# EAGLE design pic_circuit (EAGLE 9.6.2)
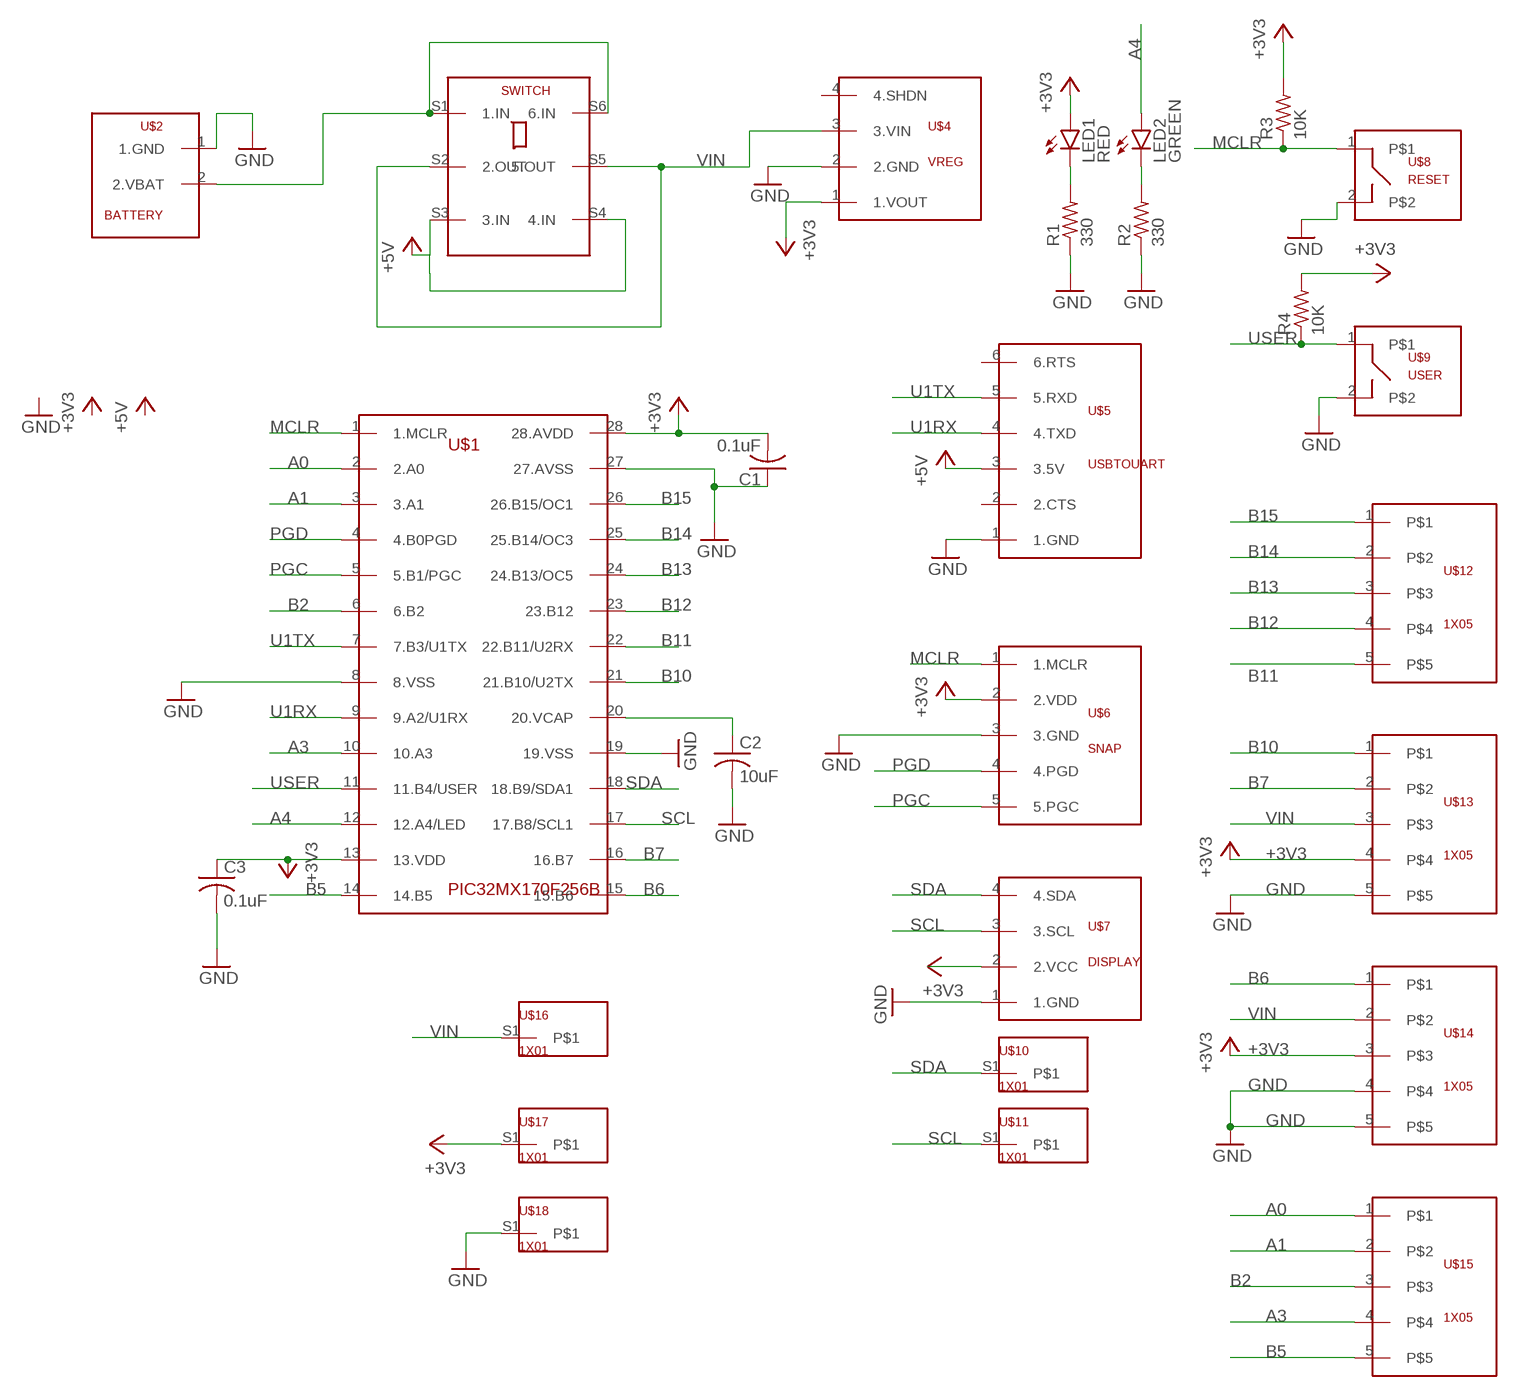
[diagram p0: schematic, sheet 1]

## Parts
C1  0.1uF  C-US025-024X044  [C025-024X044]
C2  10uF  C-US025-024X044  [C025-024X044]
C3  0.1uF  C-US025-024X044  [C025-024X044]
LED1  RED  LED3MM  [LED3MM]
LED2  GREEN  LED3MM  [LED3MM]
R1  330  R-US_0207/7  [0207/7]
R2  330  R-US_0207/7  [0207/7]
R3  10K  R-US_0207/7  [0207/7]
R4  10K  R-US_0207/7  [0207/7]
SWITCH  SLIDE  [SWITCH]
U$1  PIC32MX170F256B  [DIL28-3]
U$2  BATTERY  [BATTERY]
U$4  VREG  [VREG]
U$5  USBTOUART  [1X06]
U$6  SNAP  [SNAP]
U$7  DISPLAY  [DISPLAY]
U$8  RESET  BUTTON  [BUTTON]
U$9  USER  BUTTON  [BUTTON]
U$10  1X01  [1X01_EE]
U$11  1X01  [1X01_EE]
U$12  1X05  [1X05_EE]
U$13  1X05  [1X05_EE]
U$14  1X05  [1X05_EE]
U$15  1X05  [1X05_EE]
U$16  1X01  [1X01_EE]
U$17  1X01  [1X01_EE]
U$18  1X01  [1X01_EE]

## Nets
+3V3: C1.2 C3.1 LED1.A R3.2 R4.2 U$1.13(13.VDD) U$1.28(28.AVDD) U$4.1(1.VOUT) U$6.2(2.VDD) U$7.2(2.VCC) U$13.4 U$14.3 U$17.S1
+5V: SWITCH.S3(3.IN) SWITCH.S4(4.IN) U$5.3(3.5V)
A0: U$1.2(2.A0) U$15.1
A1: U$1.3(3.A1) U$15.2
A3: U$1.10(10.A3) U$15.4
A4: LED2.A U$1.12(12.A4/LED)
B2: U$1.6(6.B2) U$15.3
B5: U$1.14(14.B5) U$15.5
B6: U$1.15(15.B6) U$14.1
B7: U$1.16(16.B7) U$13.2
B10: U$1.21(21.B10/U2TX) U$13.1
B11: U$1.22(22.B11/U2RX) U$12.5
B12: U$1.23(23.B12) U$12.4
B13: U$1.24(24.B13/OC5) U$12.3
B14: U$1.25(25.B14/OC3) U$12.2
B15: U$1.26(26.B15/OC1) U$12.1
GND: C1.1 C2.2 C3.2 R1.1 R2.1 U$1.8(8.VSS) U$1.19(19.VSS) U$1.27(27.AVSS) U$2.1(1.GND) U$4.2(2.GND) U$5.1(1.GND) U$6.3(3.GND) U$7.1(1.GND) U$8.2 U$9.2 U$13.5 U$14.4 U$14.5 U$18.S1
MCLR: R3.1 U$1.1(1.MCLR) U$6.1(1.MCLR) U$8.1
N$1: LED1.K(C) R1.2
N$2: SWITCH.S1(1.IN) SWITCH.S6(6.IN) U$2.2(2.VBAT)
N$3: C2.1 U$1.20(20.VCAP)
N$5: LED2.K(C) R2.2
PGC: U$1.5(5.B1/PGC) U$6.5(5.PGC)
PGD: U$1.4(4.B0PGD) U$6.4(4.PGD)
SCL: U$1.17(17.B8/SCL1) U$7.3(3.SCL) U$11.S1
SDA: U$1.18(18.B9/SDA1) U$7.4(4.SDA) U$10.S1
U1RX: U$1.9(9.A2/U1RX) U$5.4(4.TXD)
U1TX: U$1.7(7.B3/U1TX) U$5.5(5.RXD)
USER: R4.1 U$1.11(11.B4/USER) U$9.1
VIN: SWITCH.S2(2.OUT) SWITCH.S5(5.OUT) U$4.3(3.VIN) U$13.3 U$14.2 U$16.S1
Unconnected: U$4.4(4.SHDN) U$5.2(2.CTS) U$5.6(6.RTS)

## Library data of the parts
C1-C3 = piccircuit:C-US: CAPACITOR, American symbol; SPICEPREFIX: C
LED1 LED2 = piccircuit:LED: LED OSRAM: - CHIPLED LG R971, LG N971, LY N971, LG Q971, LY Q971, LO R971, LY R971 LH N974, LH R974 LS Q976, LO Q976, LY Q976 LO Q996 - Hyper CHIPLED LW Q18S LB Q993, LB Q99A, LB R99A - SideLED LS A670, LO A670, LY A670, LG A670, LP A670 LB A673, LV A673, LT A673, LW A673 LH A674 LY A675 LS A676, LA A676, LO A676, LY A676, LW A676 LS A679, LY A679, LG A679 - Hyper Micro SIDELED® LS Y876, LA Y876, LO Y876, LY Y876 LT Y87S - SmartLED LW L88C, LW L88S LB L89C, LB L89S, LG L890 LS L89K, LO L89K, LY L89K LS L896, LA L896, LO L896, LY L896 - TOPLED LS T670, LO T670, LY T670, LG T670, LP T670 LSG T670, LSP T670, LSY T670, LOP T670, LYG T670 LG T671, LOG T671, LSG T671 LB T673, LV T673, LT T673, LW T673 LH T674 LS T676, LA T676, LO T676, LY T676, LB T676, LH T676, LSB T676, LW T676 LB T67C, LV T67C, LT T67C, LS T67K, LO T67K, LY T67K, LW E67C LS E67B, LA E67B, LO E67B, LY E67B, LB E67C, LV E67C, LT E67C LW T67C LS T679, LY T679, LG T679 LS T770, LO T770, LY T770, LG T770, LP T770 LB T773, LV T773, LT T773, LW T773 LH T774 LS E675, LA E675, LY E675, LS T675 LS T776, LA T776, LO T776, LY T776, LB T776 LHGB T686 LT T68C, LB T68C - Hyper Mini TOPLED® LB M676 - Mini TOPLED Santana® LG M470 LS M47K, LO M47K, LY M47K Source: http://www.osram.convergy.de LUXEON: - LUMILED® LXK2-PW12-R00, LXK2-PW12-S00, LXK2-PW14-U00, LXK2-PW14-V00 LXK2-PM12-R00, LXK2-PM12-S00, LXK2-PM14-U00 LXK2-PE12-Q00, LXK2-PE12-R00, LXK2-PE12-S00, LXK2-PE14-T00, LXK2-PE14-U00 LXK2-PB12-K00, LXK2-PB12-L00, LXK2-PB12-M00, LXK2-PB14-N00, LXK2-PB14-P00, LXK2-PB14-Q00 LXK2-PR12-L00, LXK2-PR12-M00, LXK2-PR14-Q00, LXK2-PR14-R00 LXK2-PD12-Q00, LXK2-PD12-R00, LXK2-PD12-S00 LXK2-PH12-R00, LXK2-PH12-S00 LXK2-PL12-P00, LXK2-PL12-Q00, LXK2-PL12-R00 Source: www.luxeon.com KINGBRIGHT: KA-3528ASYC Source: www.kingbright.com
R1-R4 = piccircuit:R-US_: RESISTOR, American symbol; SPICEPREFIX: R
SWITCH = piccircuit:SLIDE
U$1 = piccircuit:PIC32MX170F256B
U$2 = piccircuit:BATTERY
U$4 = piccircuit:VREG
U$5 = piccircuit:USBTOUART
U$6 = piccircuit:SNAP
U$7 = piccircuit:DISPLAY
U$8 U$9 = piccircuit:BUTTON
U$10 U$11 U$16-U$18 = piccircuit:1X01
U$12-U$15 = piccircuit:1X05

## Board
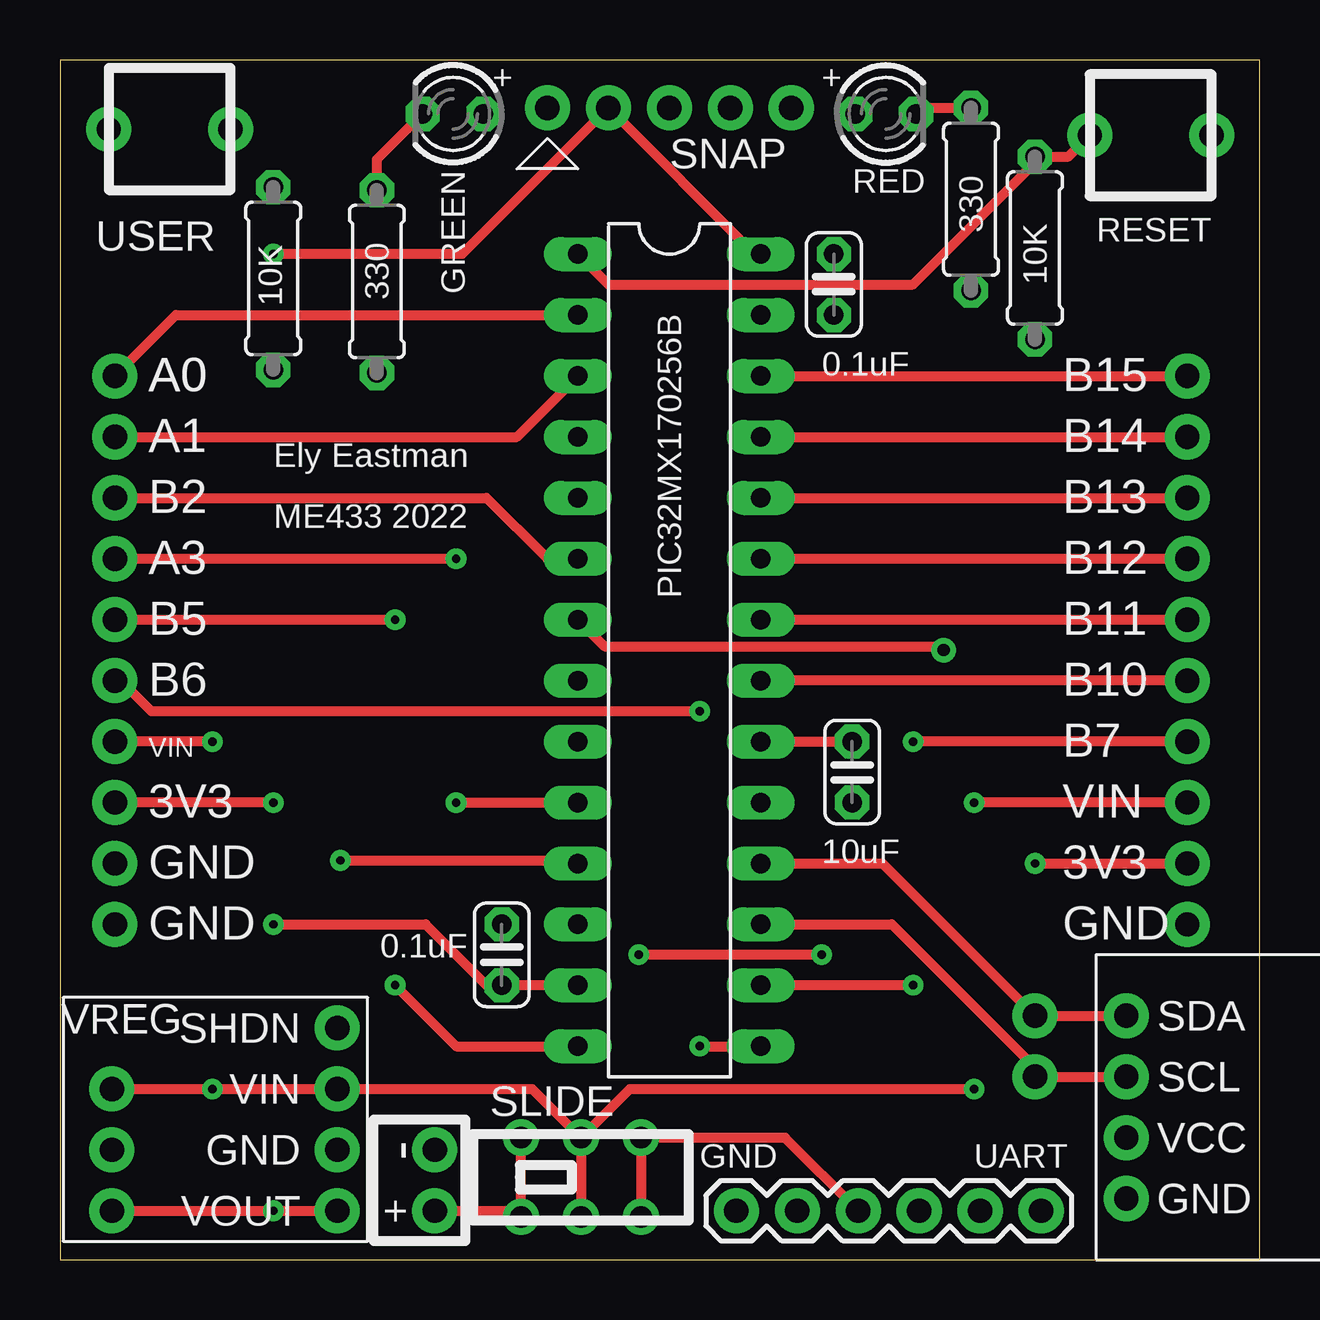
[diagram p1: board, top side]
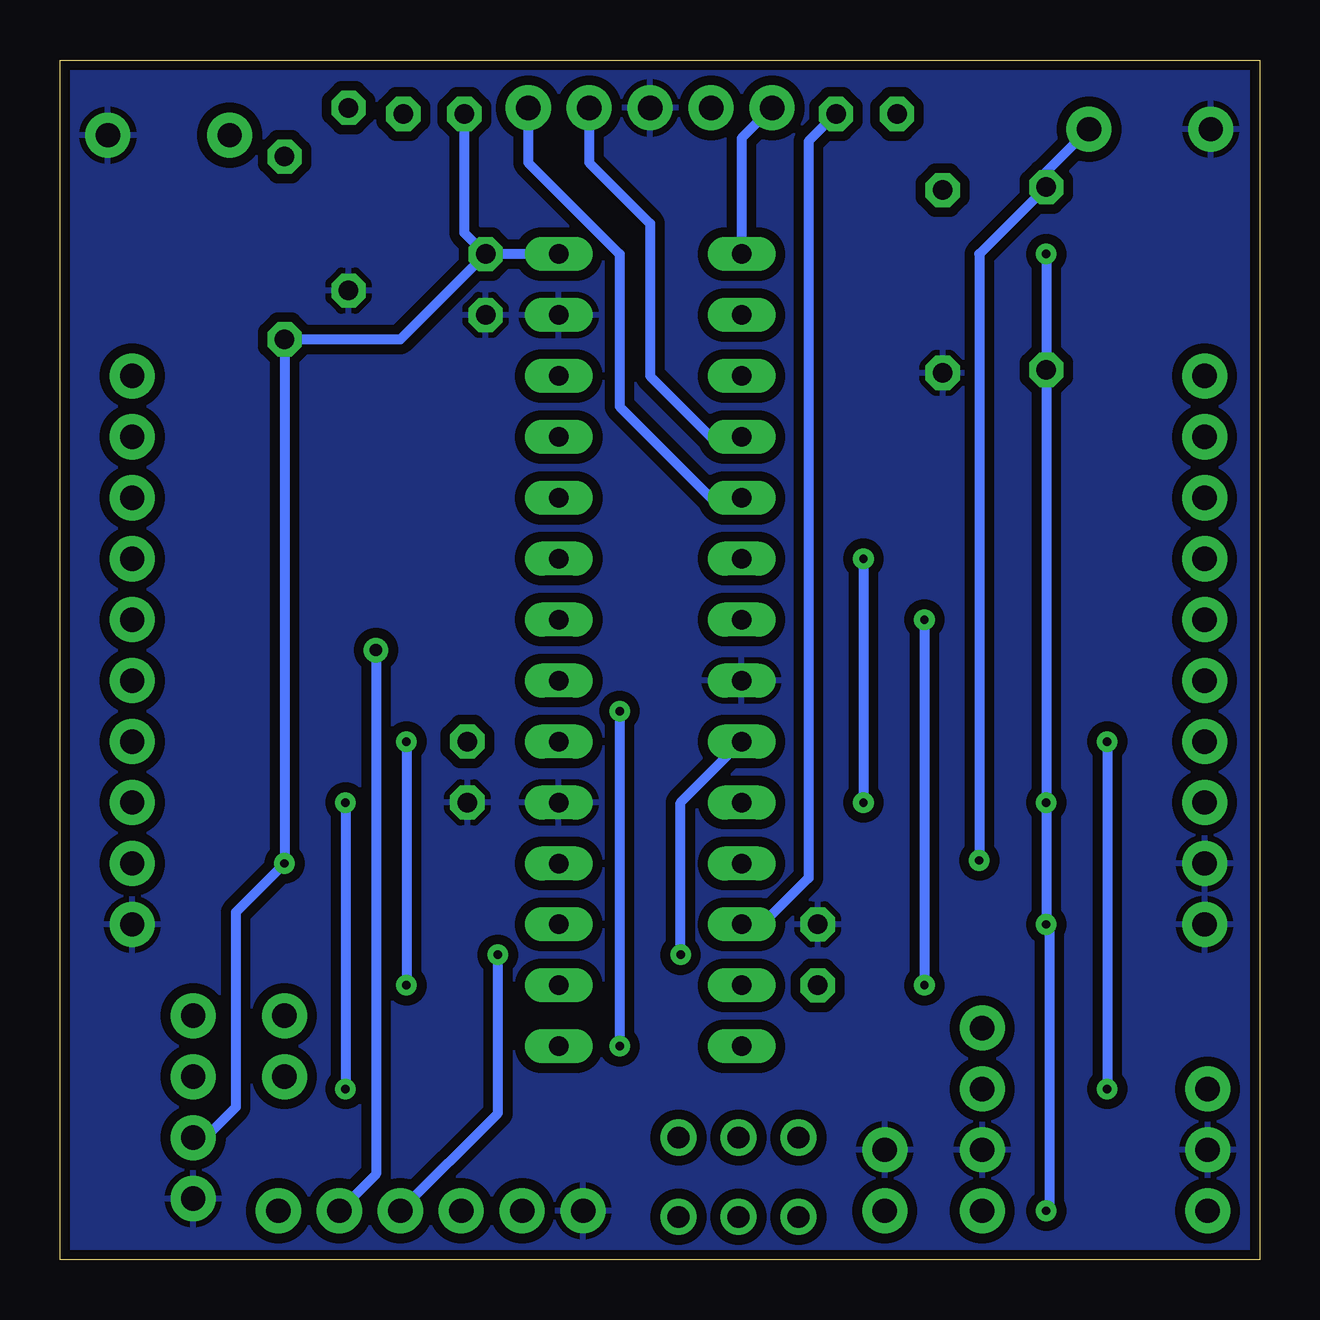
[diagram p2: board, bottom side, seen from below]

Size 50 x 50 mm. Coordinates in mm from the lower left corner, seen from the top.
Outline: 0,0 50,0 50,50 0,50 0,0
Copper layers (1*16): Top 0.035mm / dielectric 1.5mm / Bottom 0.035mm
Design rules "SparkFun": minimum track width 8mil, minimum drill 20mil, track to track 8mil, track to pad 8mil, pad to pad 8mil, via to via 8mil, smd to smd 8mil, copper to edge 10mil, drill to drill 8mil, minimum pad ring 12mil, minimum via ring 10mil, stop-mask expansion 4mil, vias tented up to drill 25mil, thermal gap 10mil

### Footprints (pad centres in the part's own frame; a part is rotated, then mirrored left to right if it is on the bottom)
C025-024X044 = drill 0.813 octagon: 1 -1.27,0; 2 1.27,0
LED3MM = drill 0.813 octagon: A -1.27,0; K 1.27,0
0207/7 = drill 0.813 octagon: 1 -3.81,0; 2 3.81,0
SWITCH = drill 0.9: S1 -2.5,-1.65; S2 0,-1.65; S3 2.5,-1.65; S4 2.5,1.65; S5 0,1.65; S6 -2.5,1.65
DIL28-3 = drill 0.813 long: 1 -16.51,-3.81; 2 -13.97,-3.81; 3 -11.43,-3.81; 4 -8.89,-3.81; 5 -6.35,-3.81; 6 -3.81,-3.81; 7 -1.27,-3.81; 8 1.27,-3.81; 9 3.81,-3.81; 10 6.35,-3.81; 11 8.89,-3.81; 12 11.43,-3.81; 13 13.97,-3.81; 14 16.51,-3.81; 15 16.51,3.81; 16 13.97,3.81; 17 11.43,3.81; 18 8.89,3.81; 19 6.35,3.81; 20 3.81,3.81; 21 1.27,3.81; 22 -1.27,3.81; 23 -3.81,3.81; 24 -6.35,3.81; 25 -8.89,3.81; 26 -11.43,3.81; 27 -13.97,3.81; 28 -16.51,3.81
BATTERY = drill 1.016 pad 1.88: 1 -1.27,0; 2 1.27,0
VREG = drill 1.016 pad 1.88: 1 -3.81,0; 2 -1.27,0; 3 1.27,0; 4 3.81,0
1X06 = drill 1.016 pad 1.88: 1 0,0; 2 2.54,0; 3 5.08,0; 4 7.62,0; 5 10.16,0; 6 12.7,0
SNAP = drill 1.016 pad 1.88: 1 -5.08,0; 2 -2.54,0; 3 0,0; 4 2.54,0; 5 5.08,0
DISPLAY = drill 1.016 pad 1.88: 1 0,-3.81; 2 0,-1.27; 3 0,1.27; 4 0,3.81
BUTTON = drill 1.016 pad 1.88: 1 -2.54,0; 2 2.54,0
1X01_EE = drill 1.016 pad 1.88: S1 0,0
1X05_EE = drill 1.016 pad 1.88: 1 -5.08,0; 2 -2.54,0; 3 0,0; 4 2.54,0; 5 5.08,0

### Placement (x,y rotation side)
C1  32.26,40.64 90 top
C2  33.02,20.32 270 top
C3  18.41,12.7 90 top
LED1  34.42,47.75 0 top
LED2  16.38,47.75 180 top
R1  37.97,44.2 90 top
R2  13.21,40.77 90 top
R3  40.64,42.16 270 top
R4  8.89,40.89 270 top
SWITCH  21.72,3.43 0 top
U$1  25.4,25.4 270 top
U$2  15.62,3.3 270 top
U$4  11.56,5.84 90 top
U$5  28.19,2.03 0 top
U$6  25.4,48.01 0 top
U$7  44.45,6.35 0 top
U$8  45.47,46.86 0 top
U$9  4.57,47.12 180 top
U$10  40.64,10.16 0 top
U$11  40.64,7.62 0 top
U$12  46.99,31.75 270 top
U$13  46.99,19.05 270 top
U$14  2.29,19.05 270 top
U$15  2.29,31.75 270 top
U$16  2.16,7.11 0 top
U$17  2.16,2.03 0 top
U$18  2.16,4.57 0 top

### Tracks (layer width: path | path; a pad name or v marks a point on that pad's centre or on a via)
+3V3  (via drill 0.35)
  Top 0.406: U$1.13 C3.1 17.78,11.43 15.24,13.97 v8.89,13.97 | U$17.S1 v8.89,2.03 U$4.1 | v40.64,16.51 U$13.4 | v8.89,19.05 U$14.3 | v8.89,41.91 16.76,41.91 U$6.2 28.96,41.91 U$1.28
  Bottom 0.406: U$1.28 C1.2 | LED1.A 33.15,42.8 C1.2 | C1.2 35.81,38.35 R3.2 v40.64,16.51 42.67,14.48 42.67,6.35 43.94,5.08 U$7.2 | v8.89,2.03 8.76,2.03 8.76,13.84 v8.89,13.97 v8.89,19.05 R4.2 v8.89,41.91
+5V
  Top 0.406: SWITCH.S3 SWITCH.S4 30.23,5.08 U$5.3
A0
  Top 0.406: U$15.1 4.83,39.37 U$1.2
A1
  Top 0.406: U$1.3 19.05,34.29 U$15.2
A3  (via drill 0.35)
  Top 0.406: U$15.4 v16.51,29.21 | v16.51,19.05 U$1.10
  Bottom 0.406: v16.51,29.21 v16.51,19.05
A4
  Bottom 0.406: LED2.A 18.8,46.61 18.8,15.9 20.73,13.97 U$1.12
B2
  Top 0.406: U$15.3 17.78,31.75 20.32,29.21 U$1.6
B5  (via drill 0.35)
  Top 0.406: U$15.5 v13.97,26.67 | U$1.14 16.51,8.89 v13.97,11.43
  Bottom 0.406: v13.97,26.67 v13.97,11.43
B6  (via drill 0.35)
  Top 0.406: U$14.1 2.54,24.13 3.81,22.86 v26.67,22.86 | v26.67,8.89 U$1.15
  Bottom 0.406: v26.67,22.86 v26.67,8.89
B7  (via drill 0.35)
  Top 0.406: U$13.2 v35.56,21.59 | v35.56,11.43 U$1.16
  Bottom 0.406: v35.56,21.59 v35.56,11.43
B10
  Top 0.406: U$13.1 U$1.21
B11
  Top 0.406: U$1.22 U$12.5
B12
  Top 0.406: U$1.23 U$12.4
B13
  Top 0.406: U$1.24 U$12.3
B14
  Top 0.406: U$1.25 U$12.2
B15
  Top 0.406: U$1.26 U$12.1
GND
  pour Bottom (isolate 0.406): 0,0 49.53,0 50.8,1.27 50.8,50.8 0,50.8
MCLR
  Top 0.406: U$1.1 22.86,40.64 35.56,40.64 40.64,45.72 R3.1 42.04,45.97 U$8.1
  Bottom 0.406: U$6.1 21.59,46.74 U$1.1
N$1
  Top 0.406: LED1.K 35.94,48.01 R1.2
N$2
  Top 0.406: U$2.2 18.96,2.03 SWITCH.S1 SWITCH.S6
N$3
  Top 0.406: U$1.20 C2.1
N$5
  Top 0.406: LED2.K 13.21,45.85 R2.2
PGC
  Bottom 0.406: U$6.5 30.48,45.72 26.67,41.91 26.67,35.56 22.86,31.75 U$1.5
PGD
  Bottom 0.406: U$6.4 27.94,45.72 25.4,43.18 25.4,36.83 22.86,34.29 U$1.4
SCL
  Top 0.406: U$11.S1 41.02,7.62 | 41.02,7.62 U$7.3 | U$1.17 34.67,13.97 41.02,7.62
SDA
  Top 0.406: U$7.4 U$10.S1 34.29,16.51 U$1.18
U1RX  (via drill 0.35)
  Top 0.406: v31.75,12.7 v24.13,12.7
  Bottom 0.406: U$5.4 31.75,6.1 v31.75,12.7 | v24.13,12.7 24.13,19.05 U$1.9
U1TX  (via drill 0.51)
  Top 0.406: U$1.7 22.71,25.55 36.93,25.55 36.96,25.53 v36.83,25.4
  Bottom 0.406: v36.83,25.4 36.83,3.56 U$5.5
USER  (via drill 0.35)
  Top 0.406: v11.68,16.64 21.46,16.64 U$1.11
  Bottom 0.406: v11.68,16.64 11.68,41.91 R4.1 8.89,45.34 U$9.1
VIN  (via drill 0.35)
  Top 0.406: U$16.S1 v6.35,7.11 U$4.3 19.68,7.11 SWITCH.S5 | SWITCH.S5 SWITCH.S2 | v6.35,21.59 U$14.2 | U$13.3 v38.1,19.05 | SWITCH.S5 23.75,7.11 v38.1,7.11
  Bottom 0.406: v6.35,21.59 v6.35,7.11 | v38.1,19.05 v38.1,7.11

### Text on the board
tPlace: + | + | RED | 330 | 10K | 10K | 330 | GREEN | 0.1uF | A0 | A0 | B15 | A1 | B14 | Ely Eastman | B2 | B13 | ME433 2022 | A3 | B12 | PIC32MX170256B | B5 | B11 | B6 | B10 | VIN | B7 | 3V3 | VIN | 10uF | GND | 3V3 | GND | 0.1uF | GND | GND | UART